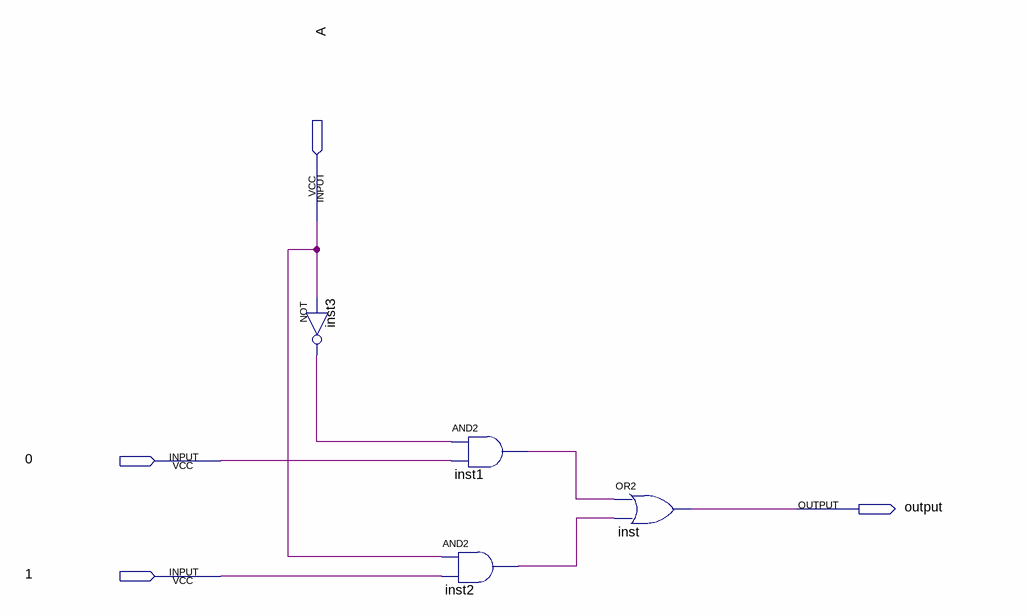
[diagram p0: schematic sheet]
// Quartus schematic demux2.bdf as structural Verilog: 4 symbols, 4 pins
module demux2 (
  input  A,
  input  \0 ,
  input  \1 ,
  output \output 
);

  wire inst1_out, inst2_out, inst3_out;

  not inst3 (inst3_out, A);
  and inst1 (inst1_out, inst3_out, \0 );
  and inst2 (inst2_out, A, \1 );
  or inst (\output , inst1_out, inst2_out);
endmodule
